# Altium project 多功能调试器V1.0.PrjPCB
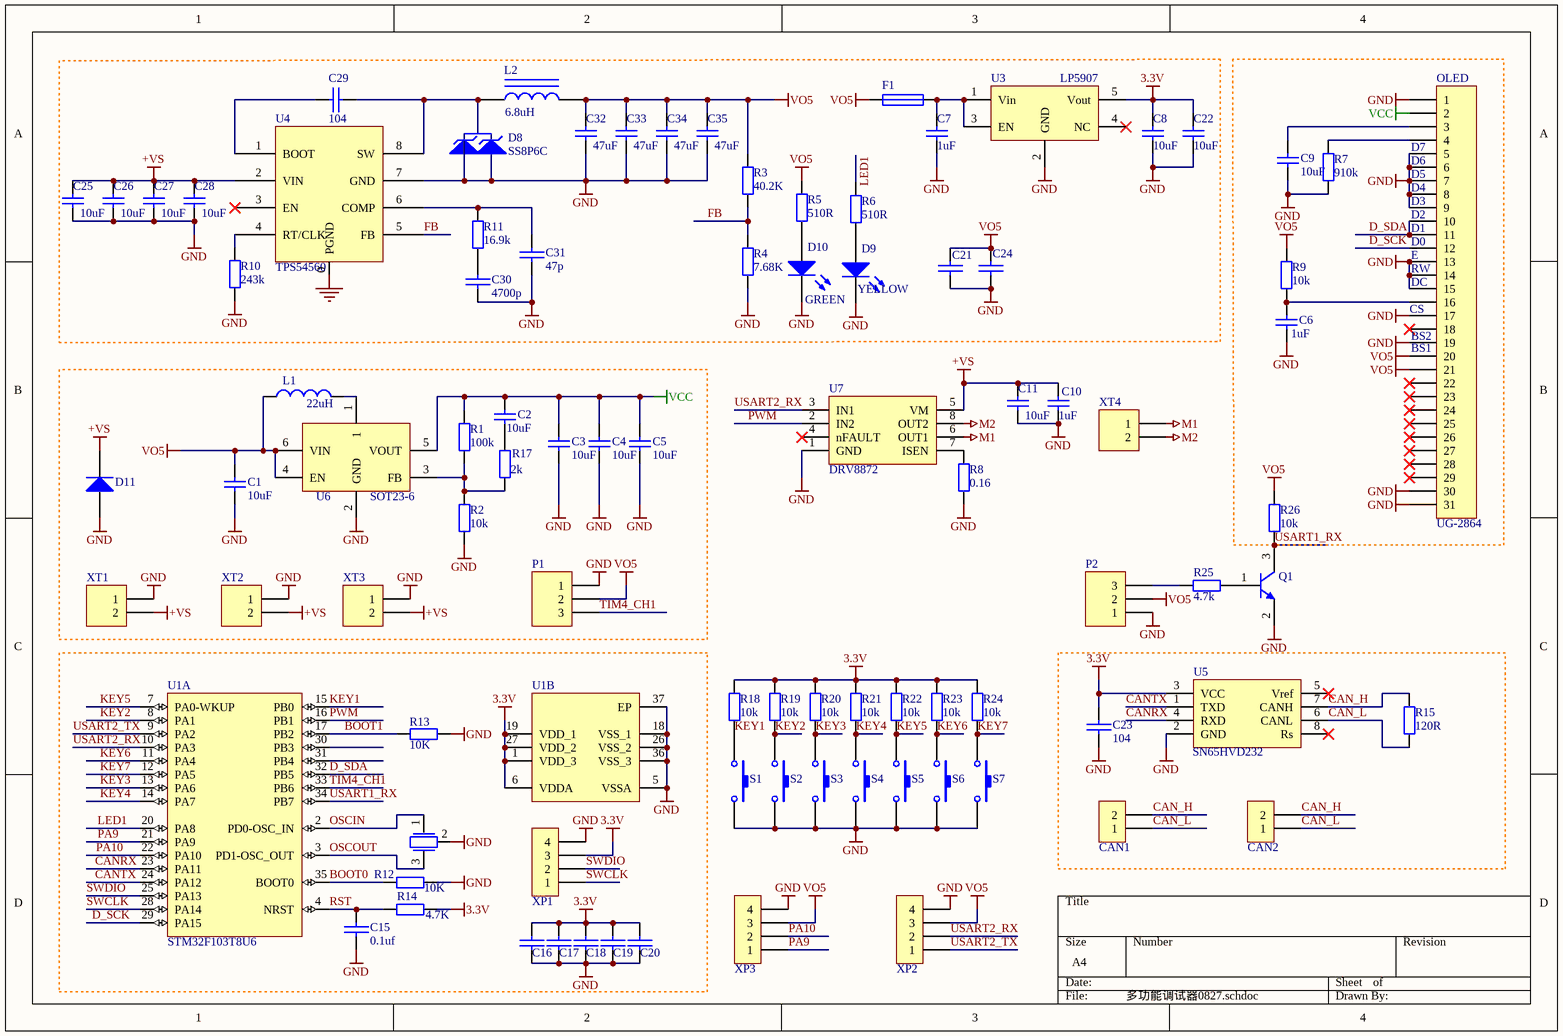
[diagram p0: 多功能调试器0827.schdoc]
1 sheet, 91 parts. Net scope: global (net labels, ports and power ports of the same name join across sheets).
Board file: 多功能调试器0827.PcbDoc

## Sheet 多功能调试器0827.schdoc
size A4

### Parts
1  (no value)  [XTAL_SMD_3215_2]
C1  value 10uF  [1210C]  (hidden comment: 2.2uF)
C2  value 10uF  [0805C]  (hidden comment: 22uF)
C3  value 10uF  [0805C]  (hidden comment: 22uF)
C4  value 10uF  [1210C]  (hidden comment: 22uF)
C5  value 10uF  [1210C]  (hidden comment: 22uF)
C6  1uF  [0805C]
C7  1uF  [0805C]
C8  value 10uF  [0805C]  (hidden comment: 1uF)
C9  value 10uF  [1210C]  (hidden comment: 22uF)
C10  1uF  [0805C]
C11  value 10uF  [1210C]  (hidden comment: 22uF)
C15  CAP  [0603C]  (value not drawn)
C16  (no value)  [0603C]
C17  104  [0603C]  (value not drawn)
C18  104  [0603C]  (value not drawn)
C19  104  [0603C]  (value not drawn)
C20  104  [0603C]  (value not drawn)
C21  104  [0603C]  (value not drawn)
C22  value 10uF  [0805C]  (hidden comment: 1uF)
C23  CAP  [0402C]  (value not drawn)
C24  104  [0805C]  (value not drawn)
C25  value 10uF  [1210C]  (hidden comment: 22uF)
C26  value 10uF  [1210C]  (hidden comment: 22uF)
C27  value 10uF  [1210C]  (hidden comment: 22uF)
C28  value 10uF  [1210C]  (hidden comment: 22uF)
C29  104  [0603C]
C30  4700p  [0603C]
C31  47p  [0603C]
C32  value 47uF  [1210C]  (hidden comment: 22uF)
C33  value 47uF  [1210C]  (hidden comment: 22uF)
C34  value 47uF  [1210C]  (hidden comment: 22uF)
C35  value 47uF  [1210C]  (hidden comment: 22uF)
CAN1  CAN  [GH1.25-WS-2P]  (value not drawn)
CAN2  CAN  [GH1.25-WS-2P]  (value not drawn)
D8  SS8P6C  [TO-227]
D9  LED0  [LED_0805_B]  (value not drawn)
D10  LED0  [LED_0805_B]  (value not drawn)
D11  (no value)  [DO214_SMA]
F1  (no value)  [0805R]
L1  value 22uH  [L6×6]  (hidden comment: 10uH)
L2  value 6.8uH  [L7-7]
OLED  UG-2864  [OLED]
P1  (no value)  [HDR2.54-LI-3P]
P2  (no value)  [HDR2.54-LI-3P]
Q1  (no value)  [SOT23_3]
R1  100k  [0805R]
R2  10k  [0805R]
R3  value 40.2K  [0603R]  (hidden comment: Res1)
R4  value 7.68K  [0603R]  (hidden comment: Res1)
R5  value 510R  [0805R]  (hidden comment: Res1)
R6  value 510R  [0805R]  (hidden comment: Res1)
R7  910k  [0805R]
R8  0.16  [1210R]
R9  10k  [0805R]
R10  243k  [0603R]
R11  16.9k  [0603R]
R12  value 10K  [0603R]  (hidden comment: Res1)
R13  value 10K  [0603R]  (hidden comment: Res1)
R14  value 4.7K  [0603R]  (hidden comment: Res1)
R15  value 120R  [0603C]  (hidden comment: Res1)
R17  2k  [0805R]
R18  10k  [0805R]
R19  10k  [0805R]
R20  10k  [0805R]
R21  10k  [0805R]
R22  10k  [0805R]
R23  10k  [0805R]
R24  10k  [0805R]
R25  4.7k  [0805R]
R26  10k  [0805R]
S1  SW-PB  [SW_PB_6*6]  (value not drawn)
S2  SW-PB  [SW_PB_6*6]  (value not drawn)
S3  SW-PB  [BUT12/B3F]  (value not drawn)
S4  SW-PB  [BUT12/B3F]  (value not drawn)
S5  SW-PB  [BUT12/B3F]  (value not drawn)
S6  SW-PB  [BUT12/B3F]  (value not drawn)
S7  SW-PB  [BUT12/B3F]  (value not drawn)
U1  STM32F103T8U6  [VFQN36_N]  (parts A,B of 2)
U3  LP5907  [SOT23_5]
U4  TPS54560  [SOIC8E]
U5  SN65HVD232  [SOp8]
U6  SOT23-6  [SOT23_6]
U7  DRV8872  [SOIC8E]
XP1  CON4  [GH1.25-WS-4P]  (value not drawn)
XP2  CON4  [GH1.25-WS-4P]  (value not drawn)
XP3  CON4  [GH1.25-WS-4P]  (value not drawn)
XT1  (no value)  [XT30PW-M]
XT2  (no value)  [XT30PW-M]
XT3  (no value)  [XT30PW-M]
XT4  (no value)  [XT30PW-M]

### Nets
3.3V: C8.2 C16.1 C17.1 C18.1 C19.1 C20.1 C22.2 C23.1 R14.1 R18.1 R19.1 R20.1 R21.1 R22.1 R23.1 R24.1 U1.1(VDD_3) U1.6(VDDA) U1.19(VDD_1) U1.27(VDD_2) U3.5(Vout) U5.3(VCC) XP1.3
+VS: C10.2 C11.1 C25.1 C26.1 C27.1 C28.1 D11.2(K) U4.2(VIN) U7.5(VM) XT1.2 XT2.2 XT3.2
GND: 1.2 C1.1 C3.1 C4.1 C5.1 C6.1 C7.1 C8.1 C9.1 C10.1 C11.2 C15.2 C16.2 C17.2 C18.2 C19.2 C20.2 C21.2 C22.1 C23.2 C24.2 C25.2 C26.2 C27.2 C28.2 C30.1 C31.1 C32.2 C33.2 C34.2 C35.2 D8.1(A) D8.2(A) D9.2(K) D10.2(K) D11.1(A) OLED.1 OLED.5 OLED.6 OLED.7 OLED.8 OLED.9 OLED.13 OLED.14 OLED.15 OLED.17 OLED.19 OLED.30 OLED.31 P1.1 P2.1 Q1.2(E) R2.1 R4.2 R7.1 R8.1 R10.2 R12.1 R13.1 S1.2 S2.2 S3.3 S4.3 S5.3 S6.3 S7.3 U1.5(VSSA) U1.18(VSS_1) U1.26(VSS_2) U1.36(VSS_3) U1.37(EP) U3.2(GND) U4.0(PGND) U4.7(GND) U5.2(GND) U6.2(GND) U7.1(GND) XP1.4 XP2.4 XP3.4 XT1.1 XT2.1 XT3.1
M1: U7.6(OUT1) XT4.1
M2: U7.8(OUT2) XT4.2
VCC: C2.2 C3.2 C4.2 C5.2 OLED.2 R1.2 U6.5(VOUT)
VO5: C1.2 C21.1 C24.1 C32.1 C33.1 C34.1 C35.1 F1.1 L1.1 L2.2 OLED.20 OLED.21 P1.2 P2.2 R3.1 R5.1 R9.1 R26.2 U6.4(EN) U6.6(VIN) XP2.3 XP3.3
BOOT0: R12.2 U1.35(BOOT0)
BOOT1: R13.2 U1.17(PB2)
CAN_H: CAN1.2 CAN2.2 R15.1 U5.7(CANH)
CAN_L: CAN1.1 CAN2.1 R15.2 U5.6(CANL)
CANRX: U1.23(PA11) U5.4(RXD)
CANTX: U1.24(PA12) U5.1(TXD)
D_SCK: OLED.12 U1.29(PA15)
D_SDA: OLED.10 OLED.11 U1.32(PB5)
FB: R3.2 R4.1 U4.5(FB)
KEY1: R18.2 S1.1 U1.15(PB0)
KEY2: R19.2 S2.1 U1.8(PA1)
KEY3: R20.2 S3.1 U1.13(PA6)
KEY4: R21.2 S4.1 U1.14(PA7)
KEY5: R22.2 S5.1 U1.7(PA0-WKUP)
KEY6: R23.2 S6.1 U1.11(PA4)
KEY7: R24.2 S7.1 U1.12(PA5)
LED1: R6.1 U1.20(PA8)
OSCIN: 1.1 U1.2(PD0-OSC_IN)
OSCOUT: 1.3 U1.3(PD1-OSC_OUT)
PA9: U1.21(PA9) XP3.1
PA10: U1.22(PA10) XP3.2
PWM: U1.16(PB1) U7.2(IN2)
RST: C15.1 R14.2 U1.4(NRST)
SWCLK: U1.28(PA14) XP1.1
SWDIO: U1.25(PA13) XP1.2
TIM4_CH1: P1.3 U1.33(PB6)
USART1_RX: Q1.3(C) R26.1 U1.34(PB7)
USART2_RX: U1.10(PA3) U7.3(IN1) XP2.2
USART2_TX: U1.9(PA2) XP2.1
NetC2_1: C2.1 R17.2
NetC6_2: C6.2 OLED.16 R9.2
NetC7_2: C7.2 F1.2 U3.1(Vin) U3.3(EN)
NetC9_2: C9.2 OLED.3
NetC29_1: C29.1 U4.1(BOOT)
NetC29_2: C29.2 D8.3(K) L2.1 U4.8(SW)
NetC30_2: C30.2 R11.2
NetC31_2: C31.2 R11.1 U4.6(COMP)
NetD9_1: D9.1(A) R6.2
NetD10_1: D10.1(A) R5.2
NetL1_2: L1.2 U6.1
NetOLED_4: OLED.4 R7.2
NetP2_3: P2.3 R25.1
NetQ1_1: Q1.1(B) R25.2
NetR1_1: R1.1 R2.2 R17.1 U6.3(FB)
NetR8_2: R8.2 U7.7(ISEN)
NetR10_1: R10.1 U4.4(RT/CLK)

Not connected (* = marked no-connect by the designer): OLED 18* 22* 23* 24* 25* 26* 27* 28* 29*; U1 30(PB3) 31(PB4); U3 4(NC)*; U4 3(EN)*; U5 5(Vref)* 8(Rs)*; U7 4(nFAULT)*

### Notes on the sheet
- (near OLED) D7
- (near OLED) D6
- (near OLED) D5
- (near OLED) D0
- (near OLED) D1
- (near OLED) D2
- (near OLED) D3
- (near OLED) D4
- GREEN
- (near D9) YELLOW
- (near OLED) CS
- (near OLED) E
- (near OLED) RW
- (near OLED) DC
- (near OLED) BS1
- (near OLED) BS2
- (in symbol CAP) 0.1uf; 104

### Library data of the parts
1 = XTAL-3PIN: 贴片晶振
C1-C11 C22 C25-C28 C32-C35 = Cap: Capacitor; Published: 8-Jun-2000; LatestRevisionDate: 17-Jul-2002; LatestRevisionNote: Re-released for DXP Platform.; PackageReference: RAD-0.3; Publisher: Altium Limited; PackageDescription: Radial Cap, Thru-Hole; 2 Leads; 0.3 in Pin Spacing
  C6 C7 C10: Value: 1uF
C16-C21 C24 = CAP
C29-C31 = CAP: Capacitor
CAN1 CAN2 = SIP2: jointbar
D9 D10 = LED0: Typical INFRARED GaAs LED; Published: 8-Jun-2000; LatestRevisionDate: 08-Jul-2005; LatestRevisionNote: Mech Layer 1 removed.; PackageReference: LED-0; Publisher: Altium Limited
D11 = Diode 1N4001: 1 Amp General Purpose Rectifier; Published: 8-Jun-2000; LatestRevisionDate: 17-Jul-2002; LatestRevisionNote: Re-released for DXP Platform.; DatasheetDocument: 1998; PackageDocument: Aug-1999; PackageReference: DO-41; Publisher: Altium Limited; Code_JEDEC: DO-204-AL; ComponentLink1Description: Manufacturer Link; ComponentLink1URL: http://www.fairchildsemi.com/; ComponentLink2Description: Datasheet; ComponentLink2URL: http://www.fairchildsemi.com/ds/1N%2F1N4001.pdf
F1 = Fuse 1: Fuse; Published: 8-Jun-2000; LatestRevisionDate: 17-Jul-2002; LatestRevisionNote: Re-released for DXP Platform.; PackageReference: PIN-W2/E2.8; Publisher: Altium Limited
L1 = Inductor: Code_IEC: 1005; TOL: 25%; PACK_TYPE: BEAD_0603; Published: 8-Jun-2000; LatestRevisionDate: 29-May-2009; LatestRevisionNote: IPC-7351 Footprint Added.; PackageReference: 0402-A; Publisher: Altium Limited; PackageDescription: Chip Inductor; Code_JEITA: 0402
L2 = Inductor Iron: Magnetic-Core Inductor; Published: 24-Mar-1999; LatestRevisionDate: 17-Jul-2002; LatestRevisionNote: Re-released for DXP Platform.; PackageReference: AXIAL-0.9; Publisher: Altium Limited; PackageDescription: Axial Device, Thru-Hole; 2 Leads; 0.9 in Pin Spacing
OLED = Header 30: Header, 30-Pin; LatestRevisionDate: 17-Jul-2002; LatestRevisionNote: Re-released for DXP Platform.; Publisher: Altium Limited
P1 P2 = Header 3: Header, 3-Pin; LatestRevisionDate: 17-Jul-2002; LatestRevisionNote: Re-released for DXP Platform.; Publisher: Altium Limited
Q1 = NPN: NPN Bipolar Transistor; Published: 8-Jun-2000; LatestRevisionDate: 17-Jul-2002; LatestRevisionNote: Re-released for DXP Platform.; PackageReference: TO-226; Publisher: Altium Limited; Code_JEDEC: TO-226-AA
R1 R7 R8 R10 R11 R17 R25 = Res2: Resistor; Value: 10K; Published: 8-Jun-2000; LatestRevisionDate: 17-Jul-2002; LatestRevisionNote: Re-released for DXP Platform.; PackageReference: AXIAL-0.4; Publisher: Altium Limited
R2 R9 R18-R24 R26 = Res2: Resistor; Published: 8-Jun-2000; LatestRevisionDate: 17-Jul-2002; LatestRevisionNote: Re-released for DXP Platform.; PackageReference: AXIAL-0.4; Publisher: Altium Limited; Value: 10K
R3-R6 R12-R15 = Res1: 贴片电阻; Published: 8-Jun-2000; LatestRevisionDate: 17-Jul-2002; LatestRevisionNote: Re-released for DXP Platform.; PackageReference: AXIAL-0.4; Publisher: Altium Limited
S1-S7 = SW-PB: Switch; Published: 24-Mar-1999; LatestRevisionDate: 17-Jul-2002; LatestRevisionNote: Re-released for DXP Platform.; PackageReference: SPST-2; Publisher: Altium Limited
U1 = STM32F103TBU6: ARM Cortex-M3 32-bit MCU, 128 KB Flash, 20 KB Internal RAM, 26 I/Os, 36-pin VFQFPN, -40 to 85 degC, Tray; A/D Converter: 2x12-bit (10 channel); FLASH Size (Prog) (kB): 128; I/Os (High Current): 26; Internal RAM Size (kB): 20; Operating Frequency(F) (Processor speed) (MHz): 72; Supply Voltage(Vcc) min (V): 2; DatasheetVersion: Rev. 16; PackageVersion: Rev. 16, 08/2013; PackageReference: VFQFPN36; PackageDescription: 36-Pin Quad Flat No-Lead, 6 x 6 x 1.0 mm Body, 0.5 mm Pitch, Exposed Pad; Supplier 1: Digi-Key; Supplier Part Number 1: 497-11534-ND; Supplier 2: Farnell; Supplier Part Number 2: 1899015; Supplier 3: Newark; Supplier Part Number 3: 73T7106; Supplier 4: Newark; Supplier Part Number 4: 90R9225; Supplier 5: Mouser; Supplier Part Number 5: 511-STM32F103TBU6; Core: ARM Cortex-M3; Packing: Tray; Mounting Technology: Surface Mount; PartNumber: STM32F103TBU6; ComponentLink1Description: Manufacturer URL; ComponentLink1URL: http://www.st.com/web/en/home.html; ComponentLink2Description: Datasheet; ComponentLink2URL: http://www.st.com/st-web-ui/static/active/en/resource/technical/document/datasheet/CD00161566.pdf; ComponentLink3Description: Package Specification; ComponentLink3URL: http://www.st.com/st-web-ui/static/active/en/resource/technical/document/datasheet/CD00161561.pdf
U6 = 未知电源芯片SOT23-6
U7 = SN65HVD232_1
XP1-XP3 = CON4: Connector
XT1-XT4 = Header 2: Header, 2-Pin; LatestRevisionDate: 17-Jul-2002; LatestRevisionNote: Re-released for DXP Platform.; Publisher: Altium Limited